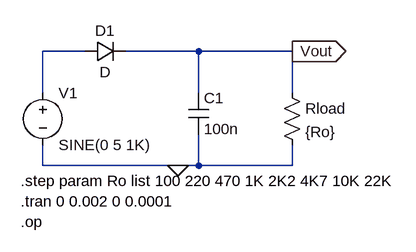
[diagram p0: schematic Draft3.asc]
Draft3.asc, the LTspice schematic file:
Version 4
SHEET 1 880 680
WIRE 64 80 0 80
WIRE 240 80 128 80
WIRE 384 80 240 80
WIRE 0 144 0 80
WIRE 240 144 240 80
WIRE 384 144 384 80
WIRE 0 256 0 224
WIRE 208 256 0 256
WIRE 240 256 240 208
WIRE 240 256 208 256
WIRE 384 256 384 224
WIRE 384 256 240 256
FLAG 208 256 0
FLAG 384 80 Vout
IOPIN 384 80 Out
SYMBOL voltage 0 128 R0
WINDOW 123 0 0 Left 2
WINDOW 39 0 0 Left 2
SYMATTR InstName V1
SYMATTR Value SINE(0 5 1K)
SYMBOL diode 64 96 R270
WINDOW 0 32 32 VTop 2
WINDOW 3 0 32 VBottom 2
SYMATTR InstName D1
SYMBOL cap 224 144 R0
SYMATTR InstName C1
SYMATTR Value 100n
SYMBOL res 368 128 R0
SYMATTR InstName Rload
SYMATTR Value {Ro}
TEXT -34 280 Left 2 !.step param Ro list 100 220 470 1K 2K2 4K7 10K 22K\n.tran 0 0.002 0 0.0001\n.op

The netlist it stands for:
* Draft3.asc
V1 N001 0 SINE(0 5 1K)
D1 N001 Vout D
C1 Vout 0 100n
Rload Vout 0 {Ro}
.model D D
.lib standard.dio
.step param Ro list 100 220 470 1K 2K2 4K7 10K 22K
.tran 0 0.002 0 0.0001
.op
.backanno
.end

* Results of the author's LTspice run, read from the files saved beside the schematic
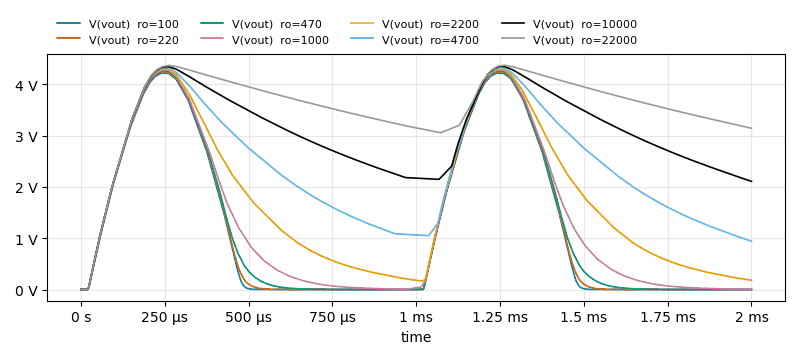
[diagram p1: Transient Analysis of Draft3.asc, plotted from the saved traces]
* Transient Analysis, 8 runs:
*   V(vout) [ro=100]: min 0 V, max 4.22 V, average 1.217 V, rms 2.007 V, last 0 V
*   V(vout) [ro=220]: min 0 V, max 4.246 V, average 1.233 V, rms 2.02 V, last 0 V
*   V(vout) [ro=470]: min 0 V, max 4.267 V, average 1.27 V, rms 2.037 V, last 7.242 µV
*   V(vout) [ro=1000]: min 0 V, max 4.288 V, average 1.393 V, rms 2.083 V, last 5.497 mV
*   V(vout) [ro=2200]: min 0 V, max 4.304 V, average 1.761 V, rms 2.256 V, last 179.6 mV
*   V(vout) [ro=4700]: min 0 V, max 4.325 V, average 2.389 V, rms 2.645 V, last 941.4 mV
*   V(vout) [ro=10000]: min 0 V, max 4.348 V, average 3.046 V, rms 3.169 V, last 2.109 V
*   V(vout) [ro=22000]: min 0 V, max 4.373 V, average 3.558 V, rms 3.64 V, last 3.145 V